# Altium schematic sheet GPS.SchDoc
size A3
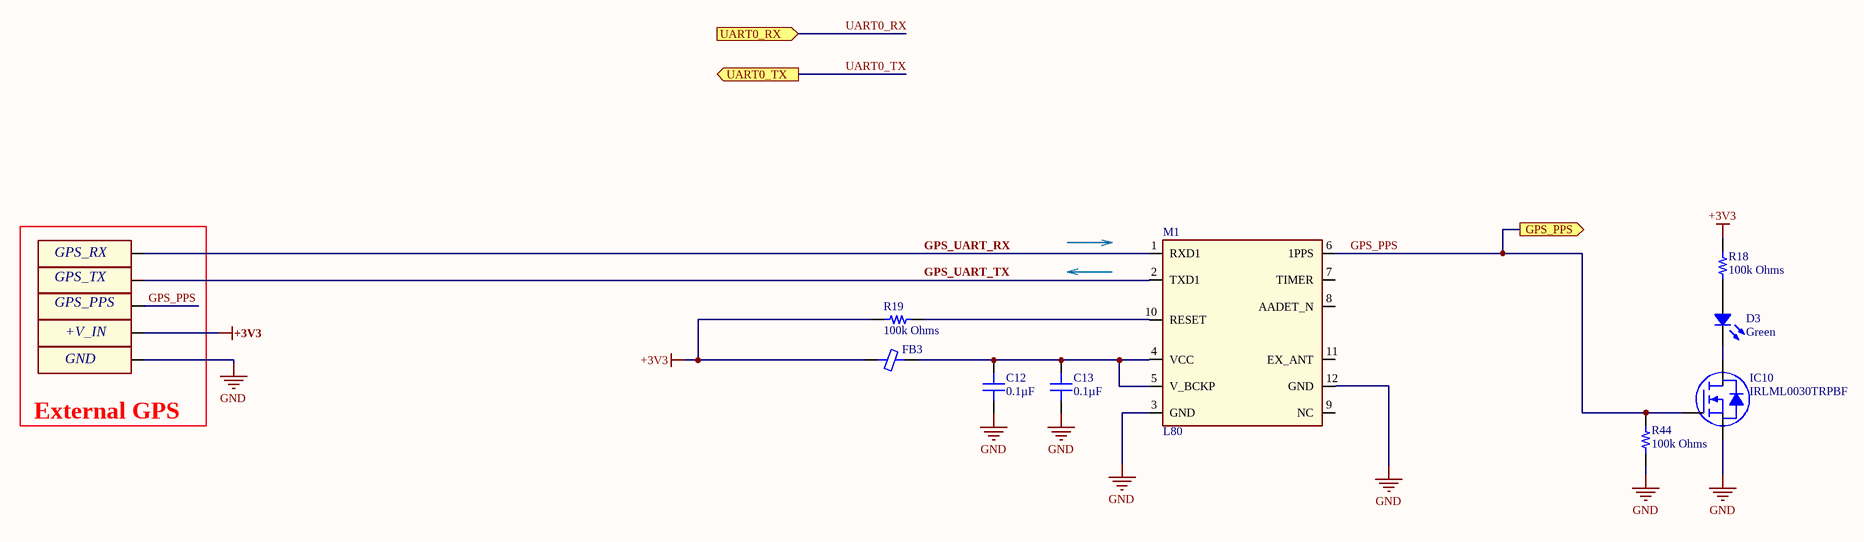
[diagram p0: GPS.SchDoc]

## Parts
C12  0.1µF  [CAP 0603_1608]
C13  0.1µF  [CAP 0603_1608]
D3  Green  [LED 0603_1608 GREEN]
FB3  (no value)  [FER 0603_1608]
IC10  IRLML0030TRPBF  [INFINEON SOT-23-3]
M1  L80  [L80 GPS]
R18  100k Ohms  [RES 0603_1608]
R19  100k Ohms  [RES 0603_1608]
R44  100k Ohms  [RES 0603_1608]
X1  GPS_RX  [PAD 1x2mm]  (no BOM)
X2  GPS_TX  [PAD 1x2mm]  (no BOM)
X3  GPS_PPS  [PAD 1x2mm]  (no BOM)
X4  +V_IN  [PAD 1x2mm]  (no BOM)
X5  GND  [PAD 1x2mm]  (no BOM)

## Blocks framed on the sheet
External GPS: X1-X5

## Ports
GPS_PPS (out), UART0_RX (in), UART0_TX (out)

## Nets
+3V3: FB3.1 R18.1 R19.1 X4.1
GND: C12.1 C13.1 IC10.2(S) M1.3(GND) M1.12(GND) R44.2 X5.1
GPS_PPS: IC10.1(G) M1.6(1PPS) R44.1 X3.1 ; port GPS_PPS
GPS_UART_RX: M1.1(RXD1) X1.1
UART0_RX: port UART0_RX
UART0_TX: port UART0_TX
NetC12_2: C12.2 C13.2 FB3.2 M1.4(VCC) M1.5(V_BCKP)
NetD3_1: D3.1 R18.2
NetD3_2: D3.2 IC10.3(D)
NetM1_2: M1.2(TXD1) X2.1
NetM1_10: M1.10(RESET) R19.2

Not connected (* = marked no-connect by the designer): M1 7(TIMER) 8(AADET_N) 9(NC) 11(EX_ANT)

## Notes on the sheet
- Labels drawn without touching a wire or pin: GPS_UART_TX

## Library data of the parts
C12 C13 = 100X14W104MV4T: CAP CER 0.1UF 10V X7R 0603; Part Number: 100X14W104MV4T; Value: 0.1µF
D3 = 5973316507F: LED GREEN 0603 SMD; Manufacturer: Dialight; Configuration: Standard; Current - Test: 20mA; Lens Color: 1.24mm; Lens Style: Round with Domed Top; Millicandela Rating: 34mcd; Voltage - Forward (Vf) (Typ): 2V; Wavelength - Dominant: 560nm; Part Number: 5973316507F; Color: Green; ComponentLink1Description: Datasheet; ComponentLink1URL: http://www.dialightsignalsandcomponents.com/Assets/Drawings/2D_Drawings_DrawingDetailedSpec/NewDrawings/C18371C.pdf; ComponentLink2Description: DigiKey Link; ComponentLink2URL: http://digikey.com/product-detail/en/dialight/5973316507F/350-4373-1-ND/9385479; Device Package: 0603 (1608 Metric); Height (Max): 1.24mm; LastUpdated: 02.09.2020 1:20:43; Lifecycle Status: Active; Minimum Order: 1; Mounting Type: Surface Mount; Package / Case: 0603 (1608 Metric); Packaging: TapeAndReel; PartId: 587; Part Status: Active; Price: 0.15; Series: 597; Size / Dimension: 1.60mm L x 0.80mm W; Supplier 1: DigiKey; Supplier Part Number 1: 350-4373-1-ND; Supplier Device Package: 0603; Value: Green
FB3 = 2506031217H0: FERRITE BEAD 0603 1LN; Part Number: 2506031217H0
IC10 = IRLML0030TRPBF: MOSFET N-CH 30V 5.3A SOT-23-3; Manufacturer: Infineon Technologies; Current - Continuous Drain (Id) @ 25°C: 5.3A (Ta); Drive Voltage (Max Rds On,  Min Rds On): 4.5V, 10V; FET Type: N-Channel; Gate Charge (Qg) (Max) @ Vgs: 2.6nC @ 4.5V; Input Capacitance (Ciss) (Max) @ Vds: 382pF @ 15V; Power Dissipation (Max): 1.3W (Ta); Rds On (Max) @ Id, Vgs: 27mOhm @ 5.2A, 10V; Vgs (Max): ±20V; Vgs(th) (Max) @ Id: 2.3V @ 25µA; Part Number: IRLML0030TRPBF; ComponentLink1Description: Datasheet; ComponentLink1URL: https://www.infineon.com/dgdl/irlml0030pbf.pdf?fileId=5546d462533600a401535664773825df; ComponentLink2Description: DigiKey Link; ComponentLink2URL: http://digikey.com/product-detail/en/infineon-technologies/IRLML0030TRPBF/IRLML0030TRPBFCT-ND/2202231; Drain to Source Voltage (Vdss): 30V; LastUpdated: 02.09.2020 1:25:05; Lifecycle Status: Active; Minimum Order: 1; Mounting Type: Surface Mount; Operating Temperature: -55°C ~ 150°C (TJ); Package / Case: TO-236-3, SC-59, SOT-23-3; Packaging: TapeAndReel; Part Status: Active; Price: 0.11; Series: HEXFET®; Supplier 1: DigiKey; Supplier Part Number 1: IRLML0030TRPBFCT-ND; Supplier Device Package: Micro3™/SOT-23; Technology: MOSFET (Metal Oxide)
M1 = L80 GPS: GPS module; Manufacturer: Quectel; Manufacturer P/N: L80-M39; Current: 0.025A; Voltage IN max: 4.3V; Корпус: 12-SMD Module; Комментарий: GPS модуль; Voltage IN min: 3V; ID: L80 GPS; Type: GPS module; Temperature: -40…+85
R18 R19 R44 = RNCS0603BKE100R: RES 100 OHM 0.1% 1/16W 0603; Part Number: RNCS0603BKE100R; Value: 100k Ohms
X1 = PAD_10: Soldering pad; Manufacturer: KHADB; Комментарий: Контактная площадка; Name: GPS_RX; ID: PAD; Pins: 1
X2 X3 = PAD_11: Soldering pad; Manufacturer: KHADB; Комментарий: Контактная площадка; ID: PAD; Pins: 1
  X2: Name: GPS_TX
  X3: Name: GPS_PPS
X4 = PAD: Soldering pad; Manufacturer: KHADB; Комментарий: Контактная площадка; ID: PAD; Pins: 1; Name: +V_IN
X5 = PAD_1: Soldering pad; Manufacturer: KHADB; Комментарий: Контактная площадка; Name: GND; ID: PAD; Pins: 1